# EAGLE schematic FinalSchematic (EAGLE 8.4.0)
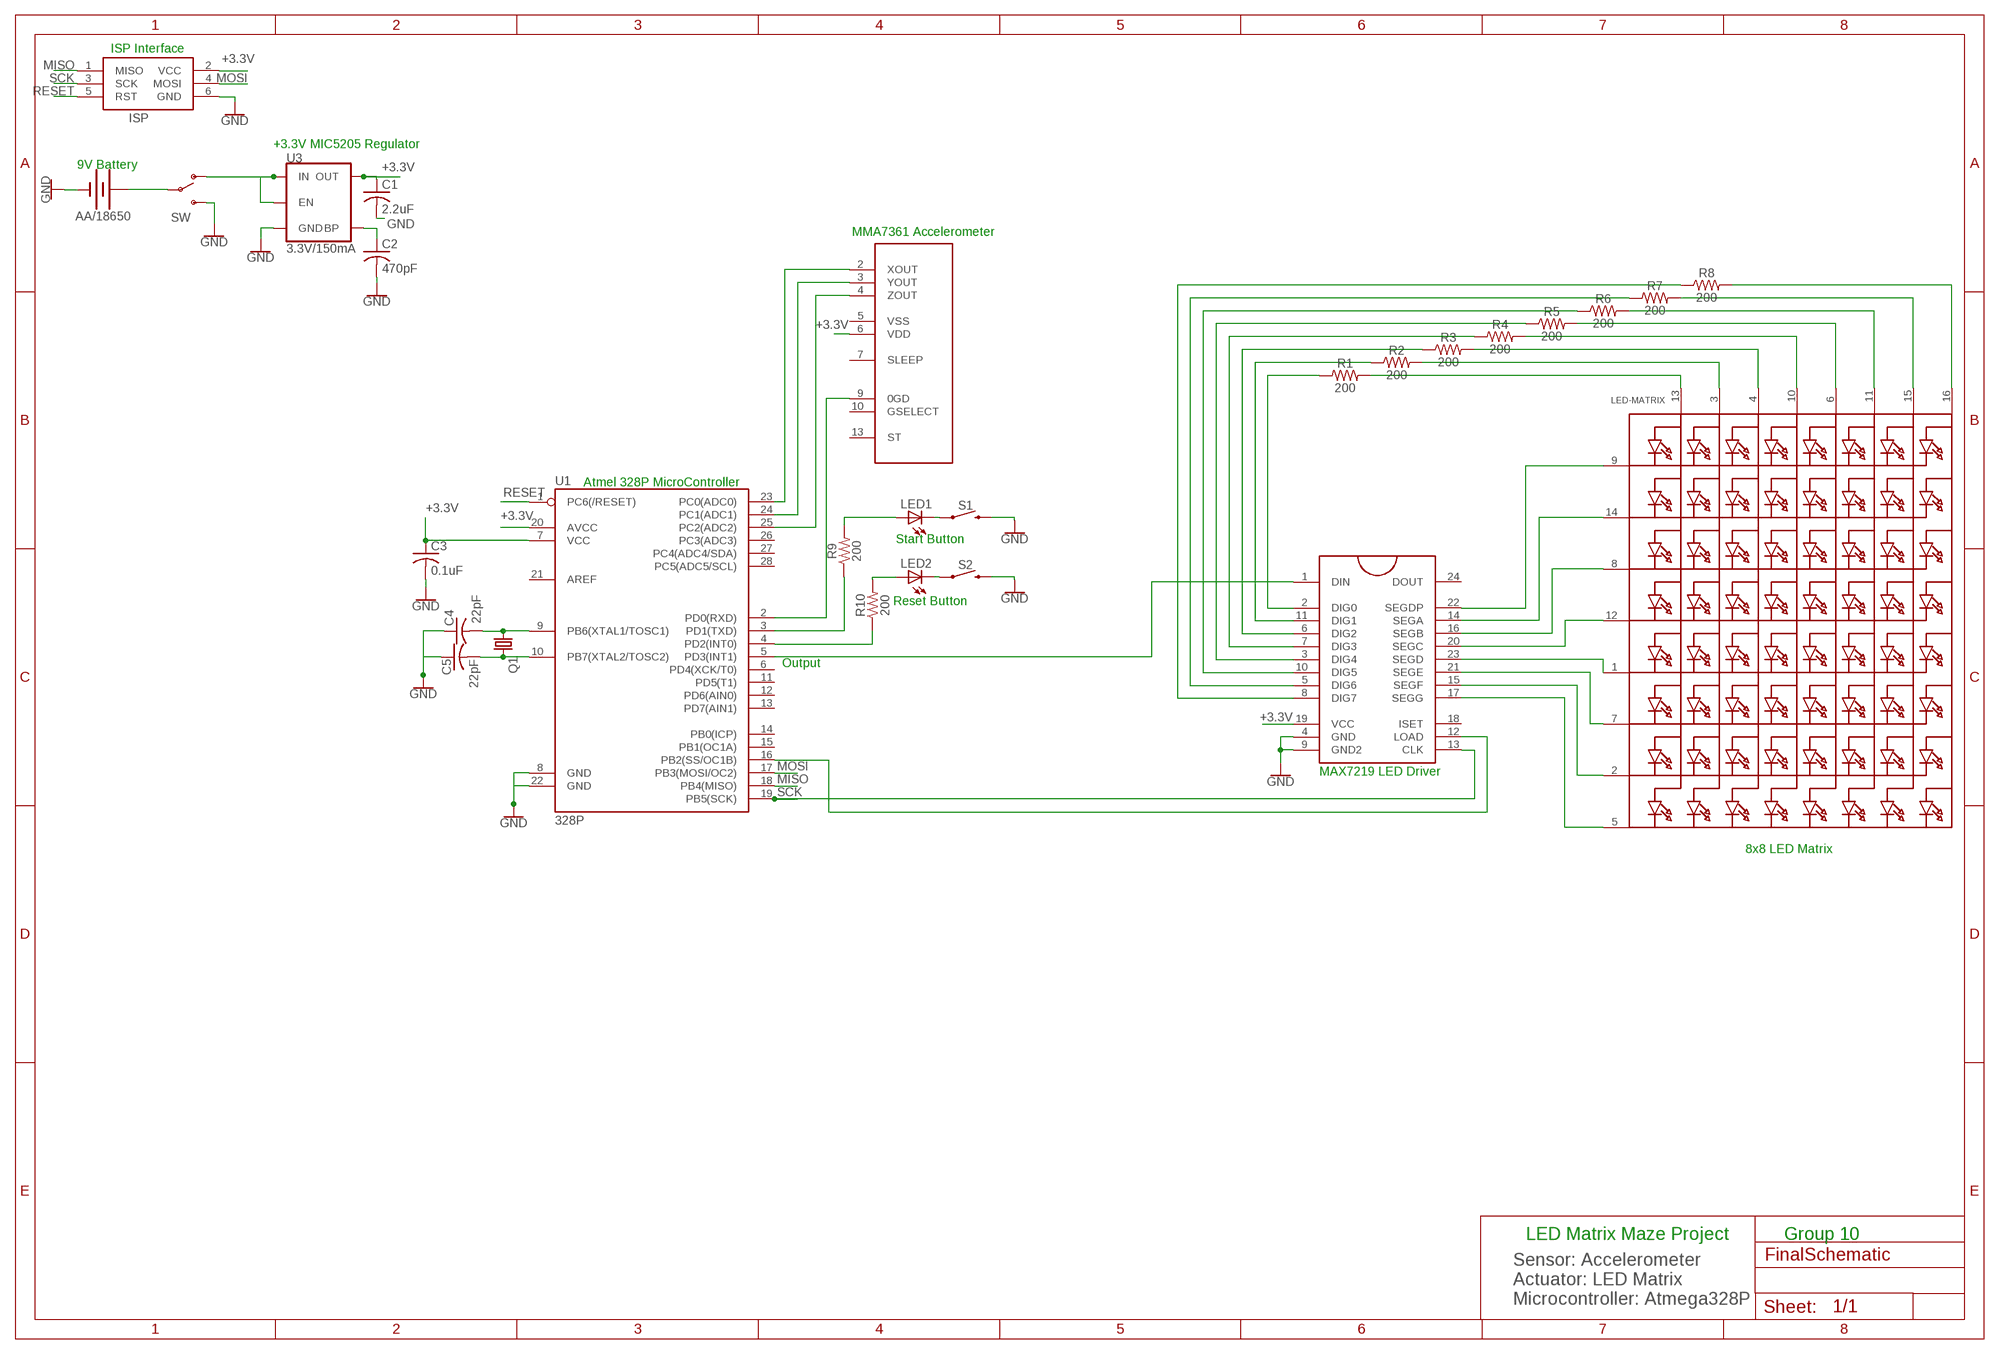
[diagram p0: schematic, sheet 1]

## Parts
AA/18650  BATTERY-9V  [BATTCON_9V]
C1  2.2uF  C-US025-024X044  [C025-024X044]
C2  470pF  C-US025-024X044  [C025-024X044]
C3  0.1uF  C-US025-024X044  [C025-024X044]
C4  22pF  C-US025-024X044  [C025-024X044]
C5  22pF  C-US025-024X044  [C025-024X044]
ISP  AVRISP-6  [AVRISP]
LED1  LED  [SMARTLED-TTW]
LED2  LED  [SMARTLED-TTW]
LED-MATRIX  SEGMENT_8X8_ROWCATHODEM12A881UR  [SEGMENT_BL-M12A881UR]
Q1  CRYSTALHC49S  [HC49/S]
R1  200  200OHM-0603-1/10W-1%  [0603]
R2  200  200OHM-0603-1/10W-1%  [0603]
R3  200  200OHM-0603-1/10W-1%  [0603]
R4  200  200OHM-0603-1/10W-1%  [0603]
R5  200  200OHM-0603-1/10W-1%  [0603]
R6  200  200OHM-0603-1/10W-1%  [0603]
R7  200  200OHM-0603-1/10W-1%  [0603]
R8  200  200OHM-0603-1/10W-1%  [0603]
R9  200  200OHM-0603-1/10W-1%  [0603]
R10  200  200OHM-0603-1/10W-1%  [0603]
S1  MOMENTARY-SWITCH-SPST-SMD-6.0X3.5MM  [TACTILE_SWITCH_SMD_6.0X3.5MM]
S2  MOMENTARY-SWITCH-SPST-SMD-6.0X3.5MM  [TACTILE_SWITCH_SMD_6.0X3.5MM]
SW  SWITCH-SPSTPTH_LOCK  [SWITCH-SPDT_LOCK.007S]
U1  328P  ATMEGA328P_PDIP  [DIP28]
U3  3.3V/150mA  V_REG_MIC52053.3V  [SOT23-5]
U$1  MAX7219DIP  [DIL24]
U$2  MMA7361  [LGA14]

## Nets
+3.3V: C1.1 C3.1 ISP.2(VCC) U1.7(VCC) U1.20(AVCC) U3.5(OUT) U$1.19(VCC) U$2.6(VDD)
GND: AA/18650.- C1.2 C2.2 C3.2 C4.1 C5.1 ISP.6(GND) S1.2 S2.2 SW.3(S) U1.8(GND) U1.22(GND) U3.2(GND) U$1.4(GND) U$1.9(GND2)
MISO: ISP.1(MISO) U1.18(PB4(MISO))
MOSI: ISP.4(MOSI) U1.17(PB3(MOSI/OC2))
N$1: LED-MATRIX.9(K1) U$1.22(SEGDP)
N$2: LED-MATRIX.14(K2) U$1.14(SEGA)
N$3: LED-MATRIX.8(K3) U$1.16(SEGB)
N$4: LED-MATRIX.12(K4) U$1.20(SEGC)
N$5: LED-MATRIX.1(K5) U$1.23(SEGD)
N$6: LED-MATRIX.7(K6) U$1.21(SEGE)
N$7: LED-MATRIX.2(K7) U$1.15(SEGF)
N$8: LED-MATRIX.5(K8) U$1.17(SEGG)
N$9: LED-MATRIX.13(A1) R1.2
N$10: R2.1 U$1.11(DIG1)
N$11: R3.1 U$1.6(DIG2)
N$12: R4.1 U$1.7(DIG3)
N$13: R5.1 U$1.3(DIG4)
N$14: R6.1 U$1.10(DIG5)
N$15: R7.1 U$1.5(DIG6)
N$16: R8.1 U$1.8(DIG7)
N$17: U1.23(PC0(ADC0)) U$2.2(XOUT)
N$18: U1.24(PC1(ADC1)) U$2.3(YOUT)
N$19: U1.25(PC2(ADC2)) U$2.4(ZOUT)
N$20: U1.5(PD3(INT1)) U$1.1(DIN)
N$21: R1.1 U$1.2(DIG0)
N$22: LED-MATRIX.3(A2) R2.2
N$23: LED-MATRIX.4(A3) R3.2
N$24: LED-MATRIX.10(A4) R4.2
N$25: LED-MATRIX.6(A5) R5.2
N$26: LED-MATRIX.11(A6) R6.2
N$27: LED-MATRIX.15(A7) R7.2
N$28: LED-MATRIX.16(A8) R8.2
N$29: SW.1(O) U3.1(IN) U3.3(EN)
N$30: C5.2 Q1.2 U1.10(PB7(XTAL2/TOSC2))
N$31: C4.2 Q1.1 U1.9(PB6(XTAL1/TOSC1))
N$32: C2.1 U3.4(BP)
N$33: U1.2(PD0(RXD)) U$2.9(0GD)
N$34: LED2.C@1(C) S2.1
N$35: LED1.C@1(C) S1.1
N$36: AA/18650.+ SW.2(P)
N$37: LED1.A@1(A) R9.2
N$38: R9.1 U1.3(PD1(TXD))
N$39: U1.16(PB2(SS/OC1B)) U$1.12(LOAD)
N$40: R10.1 U1.4(PD2(INT0))
N$41: LED2.A@1(A) R10.2
RESET: ISP.5(RST) U1.1(PC6(/RESET))
SCK: ISP.3(SCK) U1.19(PB5(SCK)) U$1.13(CLK)
Unconnected: U1.6(PD4(XCK/T0)) U1.11(PD5(T1)) U1.12(PD6(AIN0)) U1.13(PD7(AIN1)) U1.14(PB0(ICP)) U1.15(PB1(OC1A)) U1.21(AREF) U1.26(PC3(ADC3)) U1.27(PC4(ADC4/SDA)) U1.28(PC5(ADC5/SCL)) U$1.18(ISET) U$1.24(DOUT) U$2.5(VSS) U$2.7(SLEEP) U$2.10(GSELECT) U$2.13(ST)

## Notes on the sheet
- ISP Interface
- +3.3V MIC5205 Regulator
- 9V Battery
- MMA7361 Accelerometer
- Atmel 328P MicroController
- Start Button
- Reset Button
- Output
- MAX7219 LED Driver
- 8x8 LED Matrix
- LED Matrix Maze Project | Group 10
- Sensor: Accelerometer
  Actuator: LED Matrix
  Microcontroller: Atmega328P

## Library data of the parts
AA/18650 = SparkFun-Batteries:BATTERY: Battery - Single Cell A variety of battery chemistries, sizes, and footprints. Device List: 20MM_PTH - Coin Cell Battery Holder - 20mm (PTH) <https://www.sparkfun.com/products/783> 6.8MM_PTH - Coin Cell Battery Holder - 6.8MM(SMD) <https://www.digikey.com/product-detail/en/seiko-instruments/MS621FE-FL11E/728-1057-ND/1889208?WT.srch=1&gclid=CNOQ5a6LzdQCFZS2wAodXCkE0g> 12MM_SMD - Coin Cell Battery Holder - 12mm (SMD) <https://www.sparkfun.com/products/10592> 12MM_PTH - Coin Cell Battery Holder - 12mm (PTH) <https://www.sparkfun.com/products/7948> 20MM_SMD - 20mm Coin Cell Battery Holder (SMD) (2 legs) Used on the Big Time Watch Kit <https://www.sparkfun.com/products/11734> 20MM_SMD_4LEGS - Coin Cell Battery Holder - 20mm (SMD) <https://www.sparkfun.com/products/11892> 20MM_SMD_4LEGS_OVERPASTE - Coin Cell Battery Holder - 20mm (SMD) <https://www.sparkfun.com/products/11892> (Over-paste on the legs) 24.5MM_PTH - Coin Cell Battery Holder - 24.5mm (PTH) <https://www.sparkfun.com/products/8863> 9V - 9V Battery Holder - PC Mount Used on the SparkFun SparkPunk Sound Kit <https://www.sparkfun.com/products/11177> and SparkFun SparkPunk Sequencer Kit <https://www.sparkfun.com/products/12707> 18650 - Battery Holder - 18650 (PTH) <https://www.sparkfun.com/products/13113> AA - Battery Holder - 1xAA (PTH) <https://www.sparkfun.com/products/7949> AAA - Battery Holder - 1xAAA (PTH) <https://www.sparkfun.com/products/12718> AA_KIT - Battery Holder - 1xAA (PTH) <https://www.sparkfun.com/products/7949> Special kit package - pads only have exposed copper on one side of the board. AAA_KIT - Battery Holder - 1xAAA (PTH) <https://www.sparkfun.com/products/12718> Special kit package - pads only have exposed copper on one side of the board.; PROD_ID: BATT-10855
C1-C5 = adafruit:C-US: CAPACITOR, American symbol
ISP = adafruit:AVRISP: AVR ISP HEADER Standard 6 pin header for AVR programming
LED1 LED2 = adafruit:LED: LED OSRAM: - CHIPLED LG R971, LG N971, LY N971, LG Q971, LY Q971, LO R971, LY R971 LH N974, LH R974 LS Q976, LO Q976, LY Q976 LO Q996 - Hyper CHIPLED LW Q18S LB Q993, LB Q99A, LB R99A - SideLED LS A670, LO A670, LY A670, LG A670, LP A670 LB A673, LV A673, LT A673, LW A673 LH A674 LY A675 LS A676, LA A676, LO A676, LY A676, LW A676 LS A679, LY A679, LG A679 - Hyper Micro SIDELED® LS Y876, LA Y876, LO Y876, LY Y876 LT Y87S - SmartLED LW L88C, LW L88S LB L89C, LB L89S, LG L890 LS L89K, LO L89K, LY L89K LS L896, LA L896, LO L896, LY L896 - TOPLED LS T670, LO T670, LY T670, LG T670, LP T670 LSG T670, LSP T670, LSY T670, LOP T670, LYG T670 LG T671, LOG T671, LSG T671 LB T673, LV T673, LT T673, LW T673 LH T674 LS T676, LA T676, LO T676, LY T676, LB T676, LH T676, LSB T676, LW T676 LB T67C, LV T67C, LT T67C, LS T67K, LO T67K, LY T67K, LW E67C LS E67B, LA E67B, LO E67B, LY E67B, LB E67C, LV E67C, LT E67C LW T67C LS T679, LY T679, LG T679 LS T770, LO T770, LY T770, LG T770, LP T770 LB T773, LV T773, LT T773, LW T773 LH T774 LS E675, LA E675, LY E675, LS T675 LS T776, LA T776, LO T776, LY T776, LB T776 LHGB T686 LT T68C, LB T68C - Hyper Mini TOPLED® LB M676 - Mini TOPLED Santana® LG M470 LS M47K, LO M47K, LY M47K Source: http://www.osram.convergy.de/
LED-MATRIX = adafruit:SEGMENT_8X8_ROWCATHODE: 8x8 LED Segment Displays: Row = Cathode 0.7" Red 8X8 Matrix, 1.9mm Round LEDs - BL-M07C881UR 1.2" Red 8x8 Matrix, 3.0mm Round LEDs - BL-M12A881UR 1.2" Red 8x8 Matrix, 3.0mm Square LEDs - BL-M12A883
Q1 = adafruit:CRYSTAL: CRYSTAL; OC_FARNELL: 1667008; OC_NEWARK: unknown
R1-R10 = SparkFun-Resistors:200OHM: 200Ω resistor A resistor is a passive two-terminal electrical component that implements electrical resistance as a circuit element. Resistors act to reduce current flow, and, at the same time, act to lower voltage levels within circuits. - Wikipedia; PROD_ID: RES-08220
S1 S2 = SparkFun-Switches:MOMENTARY-SWITCH-SPST: Momentary Switch (Pushbutton) - SPST Normally-open (NO) SPST momentary switches (buttons, pushbuttons). Variants PTH-12MM - 12mm square, through-hole Momentary Pushbutton Switch - 12mm Square <https://www.sparkfun.com/products/9190> (COM-09190) PTH-6.0MM, PTH-6.0MM-KIT - 6.0mm square, through-hole Mini Pushbutton Switch <https://www.sparkfun.com/products/97> (COM-00097) KIT package intended for soldering kit's - only one side of pads' copper is exposed. PTH-RIGHT-ANGLE-KIT - Right-angle, through-hole Right Angle Tactile Button <https://www.sparkfun.com/products/10791> - Used on SparkFun BigTime Watch Kit <https://www.sparkfun.com/products/11734> SMD-12MM - 12mm square, surface-mount Tactile Button - SMD (12mm) <https://www.sparkfun.com/products/12993> (COM-12993) Used on SparkFun PicoBoard <https://www.sparkfun.com/products/11888> SMD-4.5MM - 4.5mm Square Trackball Switch Used on SparkFun Blackberry Trackballer Breakout <https://www.sparkfun.com/products/13169> SMD-4.6MMX2.8MM - 4.60mm x 2.80mm, surface mount Used on SparkFun SAMD21 Mini Breakout <https://www.sparkfun.com/products/13664> SMD-5.2MM, SMD-5.2-REDUNDANT - 5.2mm square, surface-mount Mini Pushbutton Switch - SMD <https://www.sparkfun.com/products/8720> (COM-08720) Used on Arduino Pro Mini <https://www.sparkfun.com/products/11114> REDUNDANT package connects both switch circuits together SMD-6.0X3.5MM - 6.0 x 3.5mm, surface mount Momentary Reset Switch SMD <https://www.sparkfun.com/products/8229> (COM-08229) SMD-6.2MM-TALL - 6.2mm square, surface mount Tactile Button - SMD (6mm) <https://www.sparkfun.com/products/12992> Used on SparkFun Digital Sandbox <https://www.sparkfun.com/products/12651> SMD-RIGHT-ANGLE - Right-angle, surface mount Used on SparkFun Block for Intel® Edison - Arduino <https://www.sparkfun.com/products/13036>; PROD_ID: SWCH-00815; SF_SKU: COM-08229
SW = SparkFun:SWITCH-SPST: SPST Switch Simple slide switch. Spark Fun Electronics SKU : COM-00102
U1 = SparkFun-IC-Microcontroller:ATMEGA328P_PDIP: Atmel 328P Through hole ATMEGA328P uC used in the Arduino 32kb flash, 1k EEPROM, 2k SRAM Datasheet <http://www.sparkfun.com/datasheets/Components/SMD/ATMega328.pdf> SparkFun Products Storefront component: AVR 28 Pin 20MHz 32K 6A/D - ATMega328P <https://www.sparkfun.com/products/9061> (COM-09061) SparkFun Simon Says - Through-Hole Soldering Kit <https://www.sparkfun.com/products/10547> (KIT-10547) SparkFun Learn to Solder - Simon Says <https://www.sparkfun.com/products/13708> (KIT-13708) SparkFun BigTime Watch Kit <https://www.sparkfun.com/products/11734> (KIT-11734) SparkFun ClockIt <https://www.sparkfun.com/products/10930> (KIT-10930) SparkFun Serial Enabled LCD Kit <https://www.sparkfun.com/products/10097> (LCD-10097) SparkFun Simon Tilts - Through Hole Soldering Kit <https://www.sparkfun.com/products/12634> (KIT-12634) SparkFun Frequency Counter Kit <https://www.sparkfun.com/products/10140> (KIT-10140) FabFM Radio Kit <https://www.sparkfun.com/products/11043> (KIT-11043) SparkFun Binary Blaster Kit <https://www.sparkfun.com/products/12037> (KIT-12037) SparkFun Metro-Gnome <https://www.sparkfun.com/products/9236> (KIT-09236) ATmega328 with Arduino Optiboot (Uno) <https://www.sparkfun.com/products/10524> (DEV-10524); PROD_ID: IC-09136
U3 = SparkFun-IC-Power:V_REG_MIC5205: V_REG MIC5205 Standard 3.3V, 5V, and Adjustable 150mA LDO voltage regulator in SOT-23 layout. Micrel part MIC5205. BP (by-pass) pin is used to lower output noise with 470pF cap, may be left open. On the adjustable version BP is used to set output.; PROD_ID: VREG-00822
U$1 = SparkFun-Retired:MAX7219: 8-digit, 8-segment LED display driver, serial input
U$2 = SparkFun:MMA7361